# EAGLE design smd-v5 (EAGLE 7.2.0)
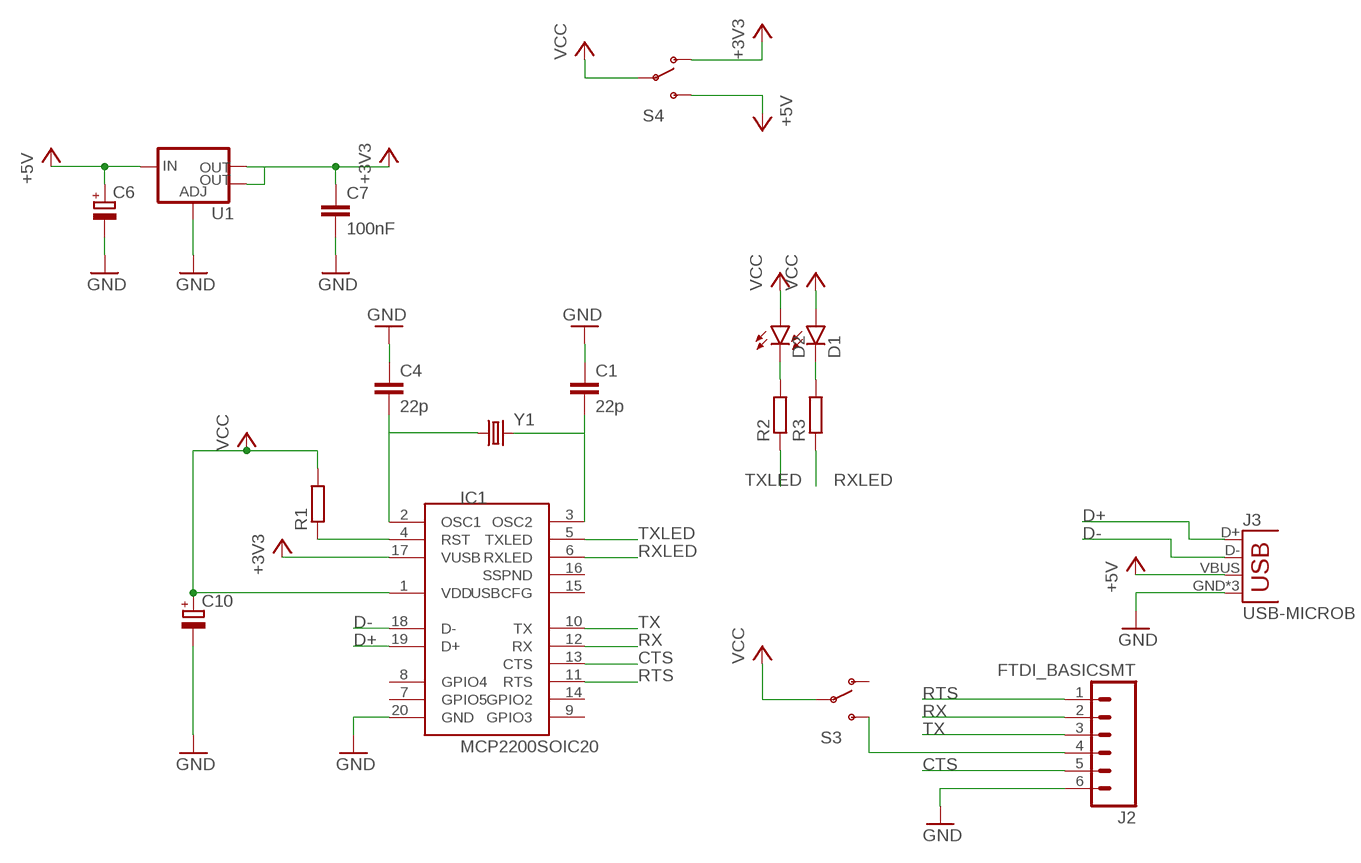
[diagram p0: schematic, sheet 1]

## Parts
C1  22p  C-EUC1206K  [C1206K]
C4  22p  C-EUC1206K  [C1206K]
C6  CPOL-EUCT3528  [CT3528]
C7  100nF  C-EUC1206K  [C1206K]
C10  CPOL-EUCT3528  [CT3528]
D1  LED1206  [LED-1206]
D2  LED1206  [LED-1206]
IC1  MCP2200SOIC20  [SOIC20]
J2  FTDI_BASICSMT  [FTDI:DEVICE_RA_SMT_NOHOLES]
J3  USB-MICROB  [USB-MICROB]
R1  R-EU_M1206  [M1206]
R2  R-EU_M1206  [M1206]
R3  R-EU_M1206  [M1206]
S3  SWITCH-SPDT-SMD-A  [SWITCH-SPST-SMD-A]
S4  SWITCH-SPDT-SMD-A  [SWITCH-SPST-SMD-A]
U1  V_REG_LM1117SOT223  [SOT223]
Y1  CRYSTALSMD  [HC49UP]

## Nets
+3V3: C7.1 IC1.17(VUSB) S4.1(O) U1.2(OUT) U1.4(OUT)
+5V: C6.+ J3.VBUS S4.3(S) U1.3(IN)
CTS: IC1.13(CTS) J2.5
D+: IC1.19(D+) J3.D+
D-: IC1.18(D-) J3.D-
GND: C1.1 C4.1 C6.- C7.2 C10.- IC1.20(GND) J2.6 J3.GND J3.MT1(GND) J3.MT2(GND) U1.1(ADJ)
N$1: C4.2 IC1.2(OSC1) Y1.1
N$2: C1.2 IC1.3(OSC2) Y1.2
N$3: D2.C R2.2
N$4: D1.C R3.2
N$8: J2.4 S3.3(S)
N$9: IC1.4(RST) R1.1
RTS: IC1.11(RTS) J2.1
RX: IC1.12(RX) J2.2
RXLED: IC1.6(RXLED) R3.1
TX: IC1.10(TX) J2.3
TXLED: IC1.5(TXLED) R2.1
VCC: C10.+ D1.A D2.A IC1.1(VDD) R1.2 S3.2(P) S4.2(P)
Unconnected: IC1.7(GPIO5) IC1.8(GPIO4) IC1.9(GPIO3) IC1.14(GPIO2) IC1.15(USBCFG) IC1.16(SSPND) S3.1(O)

## Library data of the parts
C1 C4 C7 = rcl:C-EU: CAPACITOR, European symbol
C6 C10 = rcl:CPOL-EU: POLARIZED CAPACITOR, European symbol
D1 D2 = SparkFun-LED:LED: LEDs Standard schematic elements and footprints for 5mm, 3mm, 1206, and 0603 sized LEDs. 5mm - Spark Fun Electronics SKU : COM-00529 (and others)
IC1 = microchip-update-2:MCP2200: USB 2.0 to UART Protocol Converter with GPIO
J2 = SparkFun-Connectors:FTDI_BASIC: FTDI Basic header with labels
J3 = SparkFun-Connectors:USB: USB Connectors USB-B-PTH is fully proven SKU : PRT-00139/CONN-08278 USB-miniB is fully proven SKU : PRT-00587 USB-A-PCB is untested. USB-A-H is throughly reviewed, but untested. Spark Fun Electronics SKU : PRT-00437 USB-B-SMT is throughly reviewed, but untested. Needs silkscreen touching up. USB-A-S has not been used/tested USB-MB-H has not been used/tested USB-MICROB has been used. CONN-09505; PROD_ID: CONN-09505
R1-R3 = rcl:R-EU_: RESISTOR, European symbol
S3 S4 = SparkFun-Electromechanical:SWITCH-SPDT: SPDT Switch Simple slide switch, Spark Fun Electronics SKU : COM-00102 DPDT SMT slide switch, AYZ0202, SWCH-08179; PROD_ID: SWCH-10651
U1 = SparkFun-PowerIC:V_REG_LM1117: Voltage Regulator LM1117 Standard adjustable voltage regulator but in SMD form. Spark Fun Electronics SKU : COM-00595; PROD_ID: VREG-08170
Y1 = SparkFun-FreqCtrl:CRYSTAL: Various standard crystals. Proven footprints.

## Board
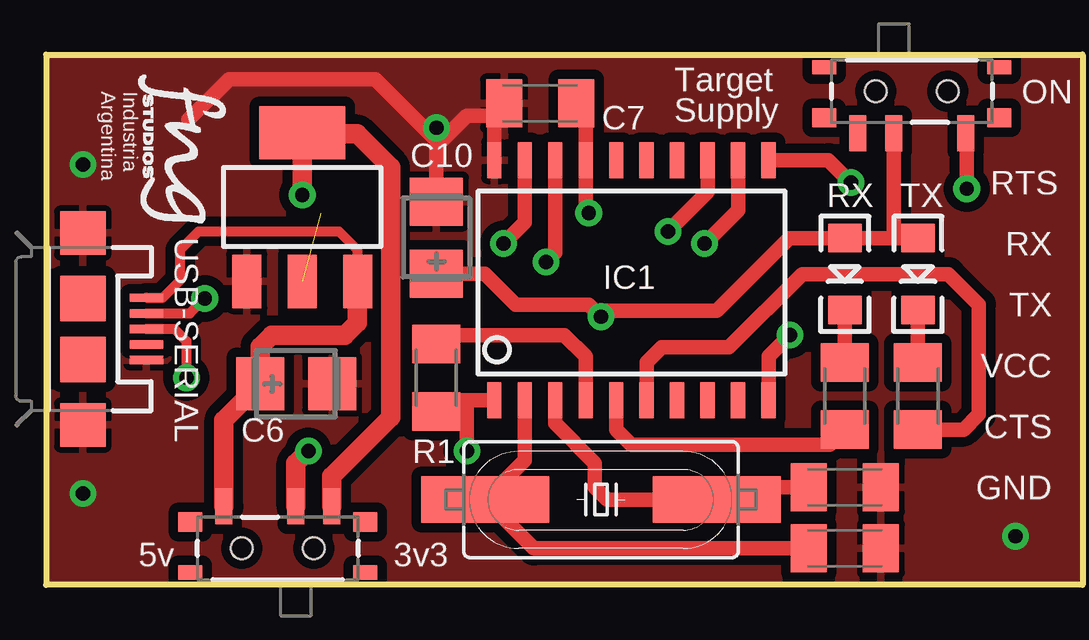
[diagram p1: board, top side]
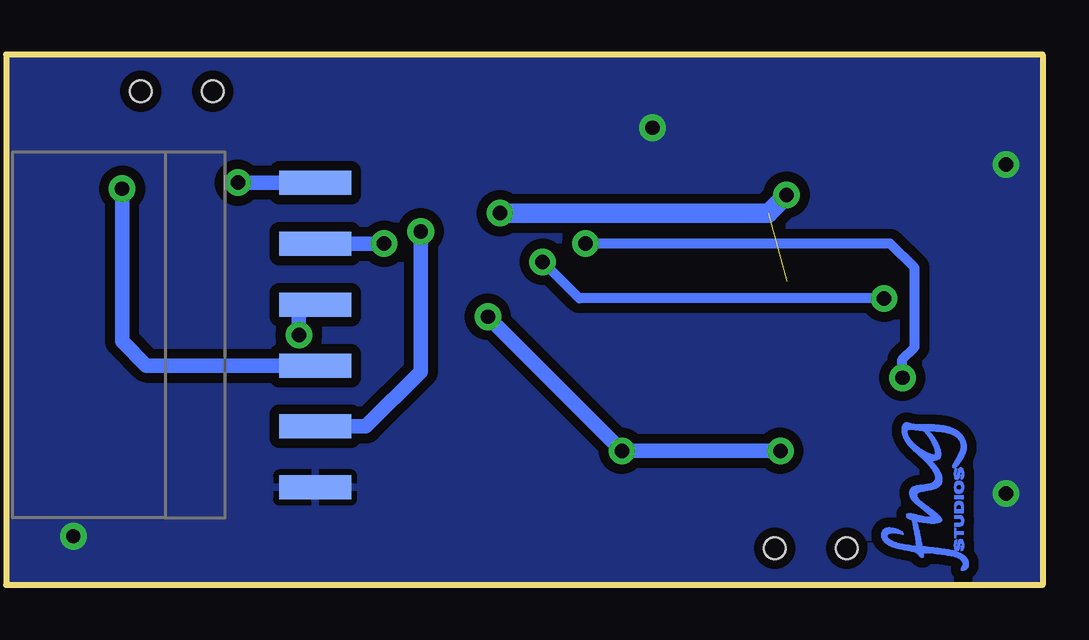
[diagram p2: board, bottom side, seen from below]

No outline drawn. Coordinates in mm, seen from the top.
Copper layers (1*16): Top 0.035mm / dielectric 1.5mm / Bottom 0.035mm
Design rules "SparkFun": minimum track width 8mil, minimum drill 20mil, track to track 8mil, track to pad 8mil, pad to pad 8mil, via to via 8mil, smd to smd 8mil, copper to edge 10mil, drill to drill 8mil, minimum pad ring 12mil, minimum via ring 10mil, stop-mask expansion 4mil, vias tented up to drill 25mil, thermal gap 10mil
Milling: 4 lines

### Footprints (pad centres in the part's own frame; a part is rotated, then mirrored left to right if it is on the bottom)
C1206K = smd 1.5 x 2: 1 -1.5,0; 2 1.5,0
CT3528 = smd 2 x 2.2: + -1.5,0; - 1.5,0
LED-1206 = smd 1.2 x 1.4: A -1.5,0; C 1.5,0
SOIC20 = smd 0.6 x 1.5: 1 -5.715,-5; 2 -4.445,-5; 3 -3.175,-5; 4 -1.905,-5; 5 -0.635,-5; 6 0.635,-5; 7 1.905,-5; 8 3.175,-5; 9 4.445,-5; 10 5.715,-5; 11 5.715,5; 12 4.445,5; 13 3.175,5; 14 1.905,5; 15 0.635,5; 16 -0.635,5; 17 -1.905,5; 18 -3.175,5; 19 -4.445,5; 20 -5.715,5
FTDI:DEVICE_RA_SMT_NOHOLES = smd 1 x 3: 1 -6.35,5; 2 -3.81,5; 3 -1.27,5; 4 1.27,5; 5 3.81,5; 6 6.35,5
USB-MICROB = smd 0.35 x 1.4: D+ 0,2.65; D- -0.65,2.65; GND 1.3,2.65; ID 0.65,2.65; VBUS -1.3,2.65 | smd 1.8 x 1.9: MT1 -4,0; MT2 4,0 | smd 1.9 x 1.9: P$1 -1.27,0; P$2 1.27,0
M1206 = smd 1.6 x 2: 1 -1.4,0; 2 1.4,0
SWITCH-SPST-SMD-A = smd 0.7 x 1.5: 1 -2.25,-1.75; 2 -0.75,-1.75; 3 2.25,-1.75 | smd 1 x 0.6: GND1 -3.65,1; GND3 3.65,1 | smd 1 x 0.8: GND2 -3.65,-1.1; GND4 3.65,-1.1 | hole 0.9: -1.5,0; 1.5,0
SOT223 = smd 1.219 x 2.235: 1 -2.311,-3.099; 2 0,-3.099; 3 2.311,-3.099 | smd 3.6 x 2.2: 4 0,3.099
HC49UP = smd 5.334 x 1.93: 1 -4.826,0; 2 4.826,0

### Placement (x,y rotation side)
C1  31.24,3.3 180 top
C4  31.24,0.76 180 top
C6  8.38,7.62 0 top
C7  18.54,19.3 180 top
C10  14.22,13.72 90 top
D1  34.29,12.19 270 top
D2  31.24,12.19 270 top
IC1  22.35,11.94 0 top
J2  33.27,9.65 270 bottom
J3  -0.51,9.91 270 top
R1  14.22,7.87 270 top
R2  31.24,7.11 90 top
R3  34.29,7.11 90 top
S3  34.04,19.81 0 top
S4  7.62,0.76 180 top
U1  8.64,14.99 0 top
U$1  [LOGOFNGNAME0.5]  1.27,20.83 270 top
U$2  [LOGOFNG0.5]  0.51,-0.51 90 bottom
Y1  21.08,2.79 0 top

### Tracks (layer width: path | path; a pad name or v marks a point on that pad's centre or on a via)
+3V3  (via drill 0.6)  (1 unrouted)
  Top 0.61: C7.1 20.45,18.9 IC1.17 20.45,14.86 v20.57,14.73 | 8.84,18.29 U1.4
  Top 0.813: S4.1 9.87,3.77 12.32,6.22 12.32,16.64 10.92,18.03 8.69,18.03 U1.4 v8.64,15.49
  Bottom 0.813: v20.57,14.73 9.4,14.73 v8.64,15.49
+5V
  Top 0.406: J3.VBUS 2.82,11.21 3.56,11.94 3.56,13.21 4.32,13.97 10.16,13.97 10.92,13.21 10.92,11.91 U1.3
  Top 0.813: S4.3 5.37,6.11 C6.+ 6.88,9.17 7.37,9.65 10.41,9.65 10.92,10.16 10.92,11.86 U1.3
CTS  (via drill 0.6)
  Top 0.61: IC1.13 25.53,15.62 v23.88,13.97
  Bottom 0.61: v23.88,13.97 23.88,8.13 26.16,5.84 J2.5
D+  (via drill 0.6)
  Top 0.406: J3.D+ 3.3,9.91 3.81,9.4 v3.81,7.87
  Top 0.61: IC1.19 17.91,14.35 v17.02,13.46
  Bottom 0.406: v3.81,7.87 3.81,8.64 3.3,9.14 3.3,12.45 4.32,13.46 v17.02,13.46
D-  (via drill 0.6)
  Top 0.406: J3.D- 3.95,10.56 v4.57,11.18
  Top 0.61: IC1.18 19.18,13.08 v18.8,12.7
  Bottom 0.406: v4.57,11.18 17.27,11.18 v18.8,12.7
GND  (via drill 0.6)
  Top 0.61: IC1.20 16.64,18.8 | 16.64,18.8 16.64,18.9 C7.2 | C10.- 14.22,17.53 14.35,17.65 | 14.35,17.65 15.49,18.8 16.64,18.8 | 3.89,18.62 5.59,20.32 11.68,20.32 14.35,17.65
  other vias: 38.35,1.27 14.22,18.29 -0.51,3.05 -0.51,16.76
  pour Top (isolate 0.406): -1.78,21.08 40.89,21.08 40.89,-0.51 -1.78,-0.51
  pour Bottom (isolate 0.406): -1.78,21.08 40.89,21.08 40.89,-0.51 -1.78,-0.51
N$1
  Top 0.61: IC1.2 17.91,4.45 Y1.1 18.29,0.76 C4.2
N$2
  Top 0.61: IC1.3 19.18,5.97 20.83,4.32 20.83,3.3 21.34,2.79 Y1.2 26.42,3.3 C1.2
N$3
  Top 0.61: D2.C R2.2
N$4
  Top 0.61: D1.C R3.2
N$8  (via drill 0.6)
  Top 0.61: v36.32,15.75 36.32,18.03 S3.3
  Bottom 0.61: v36.32,15.75 36.32,9.4 35.31,8.38 J2.4
N$9
  Top 0.61: IC1.4 20.45,8.76 19.56,9.65 14.86,9.65 R1.1
RTS  (via drill 0.6)
  Top 0.61: IC1.11 30.56,16.94 v31.5,16
  Bottom 0.61: J2.1 v31.5,16
RX  (via drill 0.6)
  Top 0.61: IC1.12 26.8,14.86 v25.4,13.46
  Bottom 0.61: J2.2 v25.4,13.46
RXLED
  Top 0.61: R3.1 36.19,5.71 36.83,6.35 36.83,10.92 35.56,12.19 29.46,12.19 26.42,9.14 23.62,9.14 22.99,8.51 IC1.6
TX  (via drill 0.6)
  Top 0.61: IC1.10 28.07,8.76 v28.96,9.65
  Bottom 0.61: v28.96,9.65 28.96,10.49 28.53,10.92 J2.3
TXLED
  Top 0.61: IC1.5 21.72,5.71 22.35,5.08 30.61,5.08 R2.1
VCC  (via drill 0.6)
  Top 0.61: IC1.1 15.49,6.94 | 15.49,6.94 14.78,6.94 R1.2 | D1.A 32.51,13.69 | 32.51,13.69 D2.A 28.93,13.69 25.91,10.67 21.34,10.67 v21.08,10.41 20.57,10.92 17.53,10.92 16.23,12.22 C10.+ | S3.2 33.29,13.7 32.51,13.69 | v15.49,4.83 15.49,6.94
  Top 0.813: S4.2 8.37,4.31 v8.89,4.83
  Bottom 0.61: v21.08,10.41 v15.49,4.83 v8.89,4.83

### Text on the board
tNames: Industria / Argentina | Target | Supply | ON | RTS | RX | TX | USB-SERIAL | RX | TX | VCC | CTS | GND | 5v | 3v3